# Altium schematic sheet Sheet_MCU_IO.SchDoc: MCU and I/O scheme
size A3; Organization: Altium Limited; Address1: L3, 12a Rodborough Rd; Address2: Frenchs Forest; Address3: NSW; Address4: Australia 2086
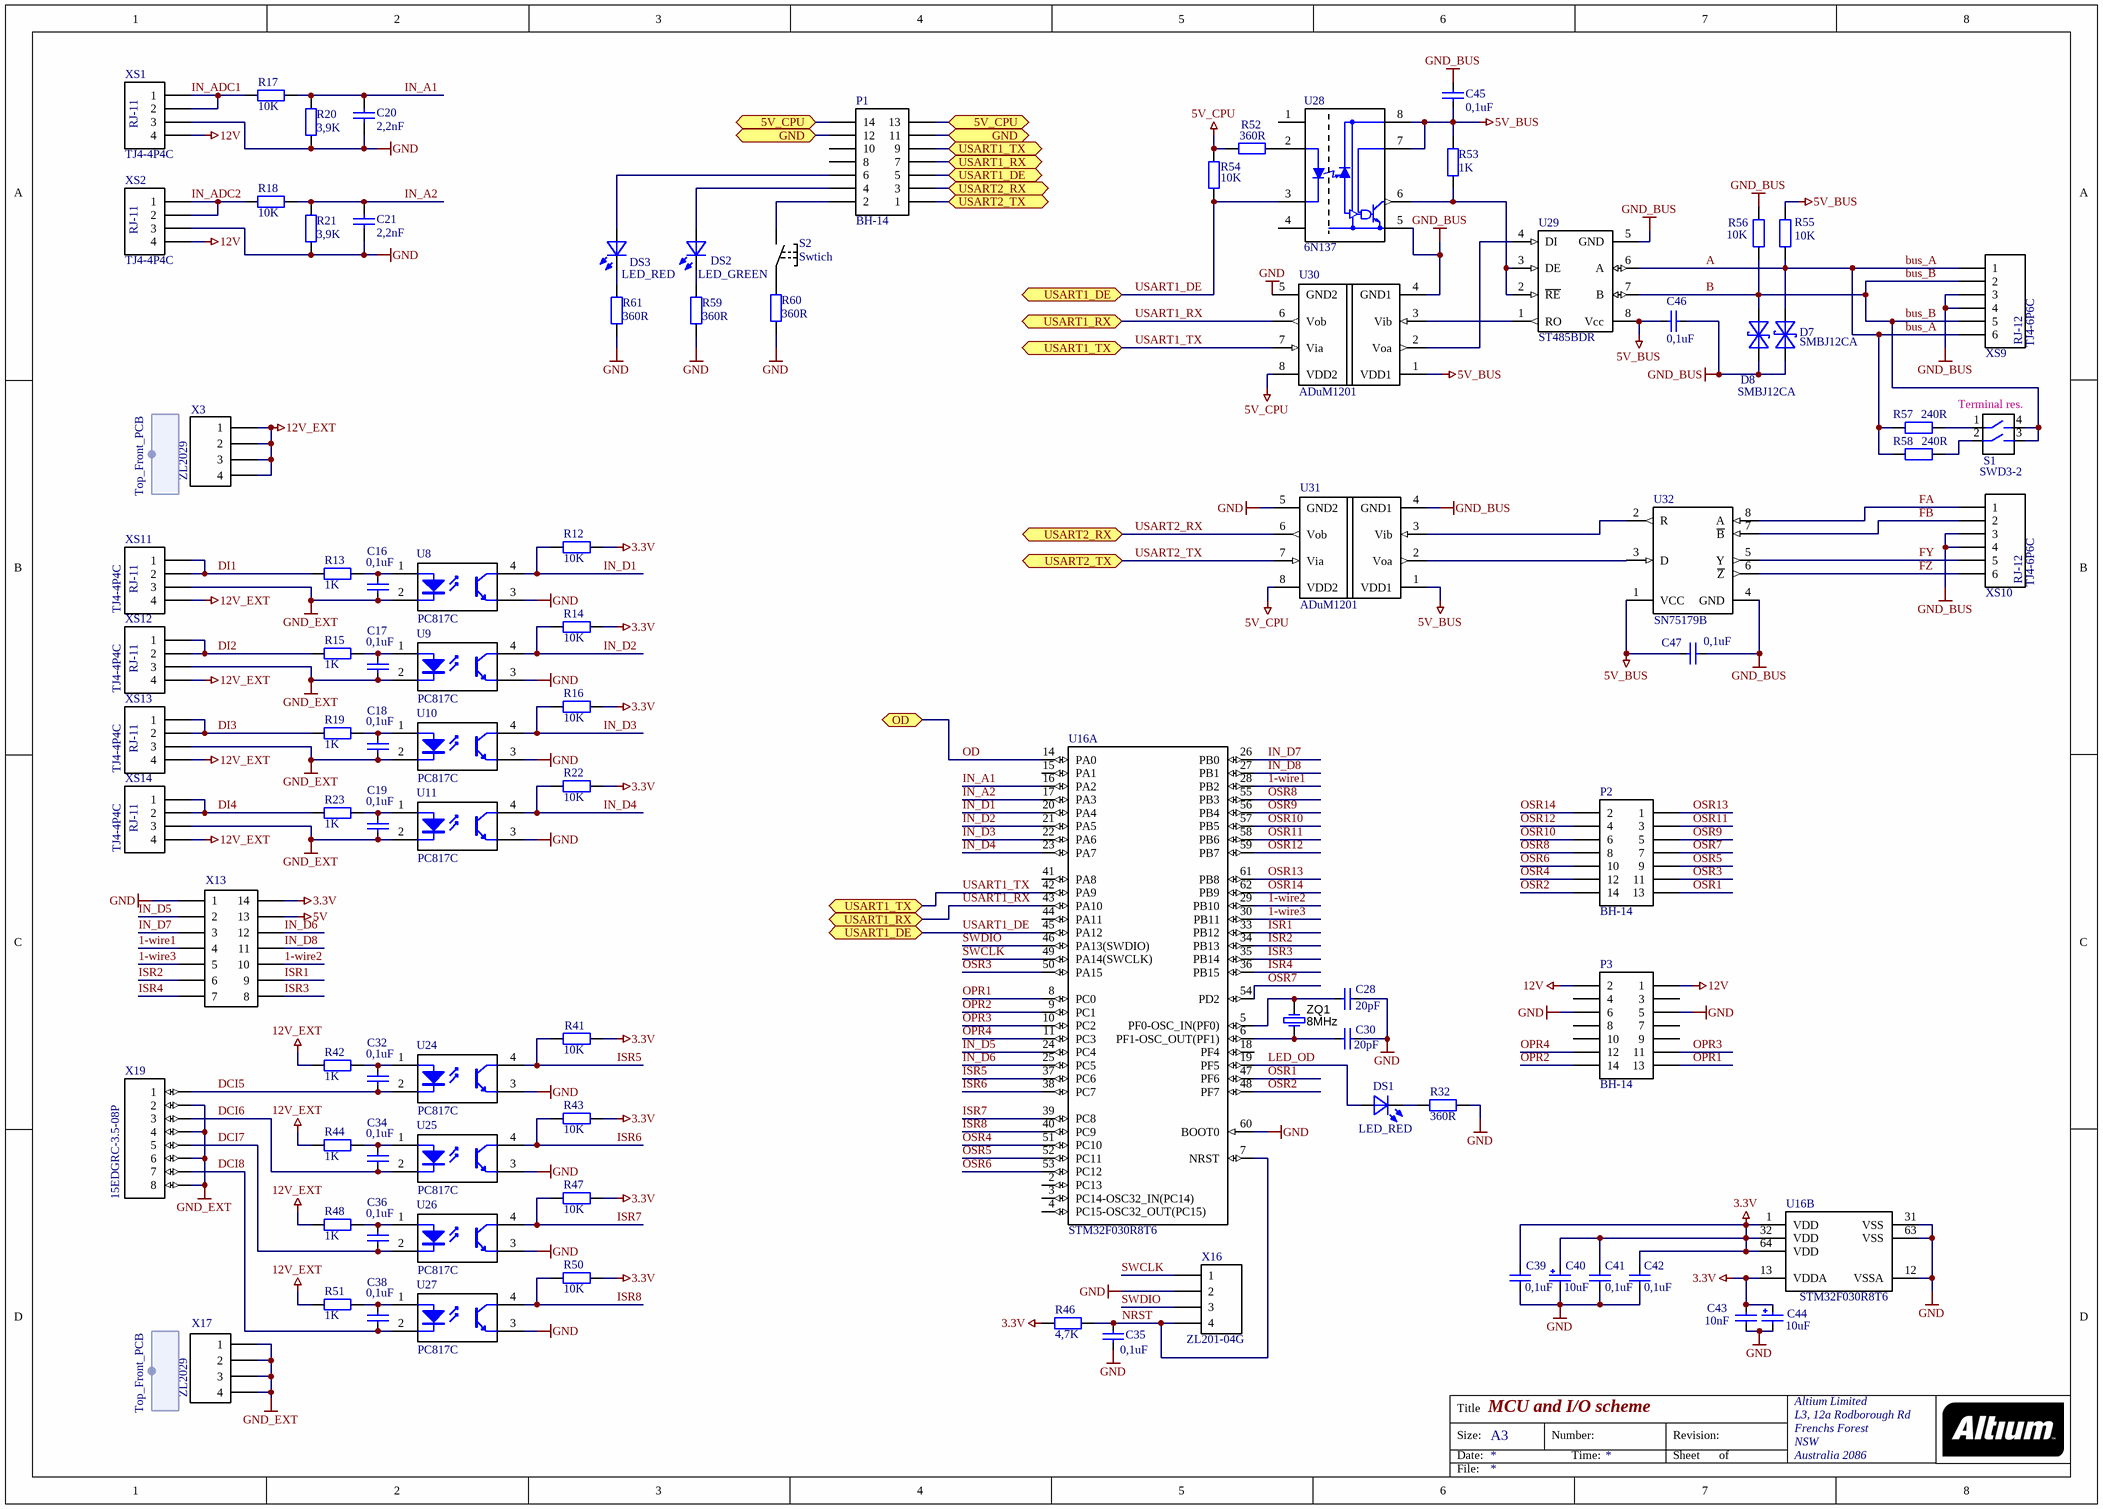
[diagram p0: Sheet_MCU_IO.SchDoc]

## Parts
C16  0,1uF  [C_0805]
C17  0,1uF  [C_0805]
C18  0,1uF  [C_0805]
C19  0,1uF  [C_0805]
C20  value 2,2nF  [C_0805]  (hidden comment: Cap_Semi)
C21  value 2,2nF  [C_0805]  (hidden comment: Cap_Semi)
C28  20pF  [C_0805]
C30  20pF  [C_0805]
C32  0,1uF  [C_0805]
C34  0,1uF  [C_0805]
C35  0,1uF  [C_0805]
C36  0,1uF  [C_0805]
C38  0,1uF  [C_0805]
C39  0,1uF  [C_0805]
C40  10uF  [5x11]
C41  0,1uF  [C_0805]
C42  0,1uF  [C_0805]
C43  10nF  [C_0805]
C44  10uF  [5x11]
C45  0,1uF  [C_0805]
C46  0,1uF  [C_0805]
C47  0,1uF  [C_0805]
D7  SMBJ12CA  [SMB]
D8  SMBJ12CA  [SMB]
DS1  LED_RED  [LED_RED]
DS2  LED_GREEN  [LED_GREEN]
DS3  LED_RED  [LED_RED]
P1  BH-14  [BH-14]
P2  BH-14  [BH-14]
P3  BH-14  [BH-14]
R12  value 10K  [R_0805]  (hidden comment: Resistor)
R13  value 1K  [R_0805]  (hidden comment: Resistor)
R14  value 10K  [R_0805]  (hidden comment: Resistor)
R15  value 1K  [R_0805]  (hidden comment: Resistor)
R16  value 10K  [R_0805]  (hidden comment: Resistor)
R17  value 10K  [R_0805]  (hidden comment: Resistor)
R18  value 10K  [R_0805]  (hidden comment: Resistor)
R19  value 1K  [R_0805]  (hidden comment: Resistor)
R20  value 3,9K  [R_0805]  (hidden comment: Resistor)
R21  value 3,9K  [R_0805]  (hidden comment: Resistor)
R22  value 10K  [R_0805]  (hidden comment: Resistor)
R23  value 1K  [R_0805]  (hidden comment: Resistor)
R32  value 360R  [R_0805]  (hidden comment: Resistor)
R41  value 10K  [R_0805]  (hidden comment: Resistor)
R42  value 1K  [R_0805]  (hidden comment: Resistor)
R43  value 10K  [R_0805]  (hidden comment: Resistor)
R44  value 1K  [R_0805]  (hidden comment: Resistor)
R46  value 4,7K  [R_0805]  (hidden comment: Resistor)
R47  value 10K  [R_0805]  (hidden comment: Resistor)
R48  value 1K  [R_0805]  (hidden comment: Resistor)
R50  value 10K  [R_0805]  (hidden comment: Resistor)
R51  value 1K  [R_0805]  (hidden comment: Resistor)
R52  value 360R  [R_0805]  (hidden comment: Resistor)
R53  value 1K  [R_0805]  (hidden comment: Resistor 0805)
R54  value 10K  [R_0805]  (hidden comment: Resistor)
R55  value 10K  [R_0805]  (hidden comment: Resistor 0805)
R56  value 10K  [R_0805]  (hidden comment: Resistor 0805)
R57  value 240R  [R_1206]  (hidden comment: Resistor 1206)
R58  value 240R  [R_1206]  (hidden comment: Resistor 1206)
R59  value 360R  [R_0805]  (hidden comment: Resistor)
R60  value 360R  [R_0805]  (hidden comment: Resistor)
R61  value 360R  [R_0805]  (hidden comment: Resistor)
S1  SW DIP-2  [Swich_DIP2]  (value not drawn)
S2  Swtich  [Swich_TACTA-68N-F_]
U8  PC817C  [DIP-4]
U9  PC817C  [DIP-4]
U10  PC817C  [DIP-4]
U11  PC817C  [DIP-4]
U16  STM32F030R8T6  [LQFP64_L]  (parts A,B of 2)
U24  PC817C  [DIP-4]
U25  PC817C  [DIP-4]
U26  PC817C  [DIP-4]
U27  PC817C  [DIP-4]
U28  6N137  [DIP-8]
U29  ST485BDR  [SO-8_N]
U30  ADuM1201  [SO-8_N]
U31  ADuM1201  [SO-8_N]
U32  SN75179B  [SO-8_L]
X3  ZL2029  [PLS-4-3D]
X13  PLS2-14  [PLS2-14]  (value not drawn)
X16  PLS-4  [PLS-4-3D]  (value not drawn)
X17  PLS-4  [PLS-4-3D]  (value not drawn)
X19  15EDGRC-3.5-08P  [MC_3.5_8]
XS1  RJ-11  [RJ-11 - TJ4-4P4C]  (value not drawn)
XS2  RJ-11  [RJ-11 - TJ4-4P4C]  (value not drawn)
XS9  RJ-12  [RJ-12 - TJ4-6P6C]  (value not drawn)
XS10  RJ-12  [RJ-12 - TJ4-6P6C]  (value not drawn)
XS11  RJ-11  [RJ-11 - TJ4-4P4C]  (value not drawn)
XS12  RJ-11  [RJ-11 - TJ4-4P4C]  (value not drawn)
XS13  RJ-11  [RJ-11 - TJ4-4P4C]  (value not drawn)
XS14  RJ-11  [RJ-11 - TJ4-4P4C]  (value not drawn)
ZQ1  8MHz  [HC49S_3D]

## Ports
5V_CPU, GND, OD, USART1_DE, USART1_RX, USART1_TX, USART2_RX, USART2_TX

## Harnesses
Top_Front_PCB: 

## Nets
3.3V: C39.1 C40.1 C41.1 C42.1 C43.1 C44.1 R12.1 R14.1 R16.1 R22.1 R41.1 R43.1 R46.1 R47.1 R50.1 U16.1(VDD) U16.13(VDDA) U16.32(VDD) U16.64(VDD) X13.14
5V: X13.13
5V_BUS: C45.1 C46.2 C47.2 R53.2 R55.2 U28.7(Ve) U28.8(Vcc) U29.8(Vcc) U30.1(VDD1) U31.1(VDD1) U32.1(VCC)
5V_CPU: R52.2 R54.2 U30.8(VDD2) U31.8(VDD2)
12V: P3.1 P3.2 XS1.4 XS2.4
12V_EXT: R42.2 R44.2 R48.2 R51.2 X3.1 X3.2 X3.3 X3.4 XS11.4 XS12.4 XS13.4 XS14.4
GND: C20.2 C21.2 C28.1 C30.1 C35.2 C39.2 C40.2 C41.2 C42.2 C43.2 C44.2 P3.5 P3.6 R20.2 R21.2 R32.2 R59.2 R60.2 R61.2 U8.3(E) U9.3(E) U10.3(E) U11.3(E) U16.12(VSSA) U16.31(VSS) U16.60(BOOT0) U16.63(VSS) U24.3(E) U25.3(E) U26.3(E) U27.3(E) U30.5(GND2) U31.5(GND2) X13.1 X16.2 XS1.3 XS2.3
GND_BUS: C45.2 C46.1 C47.1 D7.1(A) D8.2(C) R56.2 U28.5(GND) U29.5(GND) U30.4(GND1) U31.4(GND1) U32.4(GND) XS9.3 XS9.4 XS10.3 XS10.4
GND_EXT: C16.2 C17.2 C18.2 C19.2 U8.2(K) U9.2(K) U10.2(K) U11.2(K) X17.1 X17.2 X17.3 X17.4 X19.2 X19.4 X19.6 X19.8 XS11.3 XS12.3 XS13.3 XS14.3
1-wire1: U16.28(PB2) X13.4
1-wire2: U16.29(PB10) X13.10
1-wire3: U16.30(PB11) X13.5
5V_CPU: P1.13 P1.14 ; port 5V_CPU  [a separate net that carries the same name]
A: D7.2(C) R55.1 R57.1 R58.1 U29.6(A) XS9.1 XS9.6  [also labelled bus_A]
B: D8.1(A) R56.1 S1.3 S1.4 U29.7(B) XS9.2 XS9.5  [also labelled bus_B]
DCI5: C32.2 U24.2(K) X19.1
DCI6: C34.2 U25.2(K) X19.3
DCI7: C36.2 U26.2(K) X19.5
DCI8: C38.2 U27.2(K) X19.7
DI1: R13.2 XS11.1 XS11.2
DI2: R15.2 XS12.1 XS12.2
DI3: R19.2 XS13.1 XS13.2
DI4: R23.2 XS14.1 XS14.2
FA: U32.8(A) XS10.1
F~{B}: U32.7(~{B}) XS10.2
FY: U32.5(Y) XS10.5
F~{Z}: U32.6(~{Z}) XS10.6
GND: P1.11 P1.12 ; port GND  [a separate net that carries the same name]
IN_A1: C20.1 R17.1 R20.1 U16.16(PA2)
IN_A2: C21.1 R18.1 R21.1 U16.17(PA3)
IN_ADC1: R17.2 XS1.1 XS1.2
IN_ADC2: R18.2 XS2.1 XS2.2
IN_D1: R12.2 U8.4(C) U16.20(PA4)
IN_D2: R14.2 U9.4(C) U16.21(PA5)
IN_D3: R16.2 U10.4(C) U16.22(PA6)
IN_D4: R22.2 U11.4(C) U16.23(PA7)
IN_D5: U16.24(PC4) X13.2
IN_D6: U16.25(PC5) X13.12
IN_D7: U16.26(PB0) X13.3
IN_D8: U16.27(PB1) X13.11
ISR1: U16.33(PB12) X13.9
ISR2: U16.34(PB13) X13.6
ISR3: U16.35(PB14) X13.8
ISR4: U16.36(PB15) X13.7
ISR5: R41.2 U16.37(PC6) U24.4(C)
ISR6: R43.2 U16.38(PC7) U25.4(C)
ISR7: R47.2 U16.39(PC8) U26.4(C)
ISR8: R50.2 U16.40(PC9) U27.4(C)
LED_OD: DS1.1(A) U16.19(PF5)
NRST: C35.1 R46.2 U16.7(NRST) X16.4
OD: U16.14(PA0) ; port OD
OPR1: P3.13 U16.8(PC0)
OPR2: P3.14 U16.9(PC1)
OPR3: P3.11 U16.10(PC2)
OPR4: P3.12 U16.11(PC3)
OSR1: P2.13 U16.47(PF6)
OSR2: P2.14 U16.48(PF7)
OSR3: P2.11 U16.50(PA15)
OSR4: P2.12 U16.51(PC10)
OSR5: P2.9 U16.52(PC11)
OSR6: P2.10 U16.53(PC12)
OSR7: P2.7 U16.54(PD2)
OSR8: P2.8 U16.55(PB3)
OSR9: P2.5 U16.56(PB4)
OSR10: P2.6 U16.57(PB5)
OSR11: P2.3 U16.58(PB6)
OSR12: P2.4 U16.59(PB7)
OSR13: P2.1 U16.61(PB8)
OSR14: P2.2 U16.62(PB9)
SWCLK: U16.49(PA14(SWCLK)) X16.1
SWDIO: U16.46(PA13(SWDIO)) X16.3
USART1_DE: P1.5 R54.1 U16.45(PA12) U28.3(C) ; port USART1_DE
USART1_RX: P1.7 U16.43(PA10) U30.6(Vob) ; port USART1_RX
USART1_TX: P1.9 U16.42(PA9) U30.7(Via) ; port USART1_TX
USART2_RX: P1.3 U31.6(Vob) ; port USART2_RX
USART2_TX: P1.1 U31.7(Via) ; port USART2_TX
NetC16_1: C16.1 R13.1 U8.1(A)
NetC17_1: C17.1 R15.1 U9.1(A)
NetC18_1: C18.1 R19.1 U10.1(A)
NetC19_1: C19.1 R23.1 U11.1(A)
NetC28_2: C28.2 U16.5(PF0-OSC_IN(PF0)) ZQ1.2(OSC2)
NetC30_2: C30.2 U16.6(PF1-OSC_OUT(PF1)) ZQ1.1(OSC1)
NetC32_1: C32.1 R42.1 U24.1(A)
NetC34_1: C34.1 R44.1 U25.1(A)
NetC36_1: C36.1 R48.1 U26.1(A)
NetC38_1: C38.1 R51.1 U27.1(A)
NetDS1_2: DS1.2(C) R32.1
NetDS2_1: DS2.1(A) P1.4
NetDS2_2: DS2.2(C) R59.1
NetDS3_1: DS3.1(A) P1.6
NetDS3_2: DS3.2(C) R61.1
NetP1_2: P1.2 S2.2(NO)
NetR52_1: R52.1 U28.2(A)
NetR53_1: R53.1 U28.6(Vo) U29.2(~{RE}) U29.3(DE)
NetR57_2: R57.2 S1.1
NetR58_2: R58.2 S1.2
NetR60_1: R60.1 S2.1(COMMON)
NetU29_1: U29.1(RO) U30.3(Vib)
NetU29_4: U29.4(DI) U30.2(Voa)
NetU31_2: U31.2(Voa) U32.3(D)
NetU31_3: U31.3(Vib) U32.2(R)

Not connected (* = marked no-connect by the designer): P1 8 10; P3 3 4 7 8 9 10; U16 2(PC13) 3(PC14-OSC32_IN(PC14)) 4(PC15-OSC32_OUT(PC15)) 15(PA1) 18(PF4) 41(PA8) 44(PA11); U28 1(NC) 4(NC)

## Notes on the sheet
- (near S1) Terminal res.
- Title
- Size:
- Date:
- A3
- Number:
- Time:
- Revision:
- Sheet
- of
- File:
- (in symbol SW DIP-2) SWD3-2

## Library data of the parts
C16-C19 C28 C30 C32 C34-C36 C38 C39 C41-C43 C45-C47 = Cap_Semi: Capacitor semi
C20 C21 = Cap_Semi: Capacitor Semi
C40 C44 = Capacitor Polar
D7 D8 = SMBJ12CA: Supressor
DS1 DS3 = LED_RED: LED
DS2 = LED_GREEN: LED
P1-P3 = BH-14: IDC/BH; LatestRevisionDate: 17-Jul-2002; LatestRevisionNote: Re-released for DXP Platform.; Publisher: Altium Limited
S1 = SW DIP-2: DIP Switch_2
U8-U11 U24-U27 = PC817: Optocoupler
U16 = STM32F030R8T6: ARM Cortex-M0 32-bit MCU, 64 KB Flash, 8 KB Internal RAM, 55 I/Os, 64-pin LQFP, -40 to 85 degC, Tray
U28 = 6N137: Optocoupler
U29 = ST485BDR: RS-485/RS-422 Transceiver
U30 U31 = ADuM1201: Dual-Channel Digital Isolators
U32 = SN75179B: RS485/RS422 Differential driver and receiver pair
X3 = PLS-4: Header, 4-Pin; LatestRevisionDate: 17-Jul-2002; LatestRevisionNote: Re-released for DXP Platform.; Publisher: Altium Limited
X13 = PLS2-14: Header, 14-Pin
X16 = PLS-4: ZL201-04G; LatestRevisionDate: 17-Jul-2002; LatestRevisionNote: Re-released for DXP Platform.; Publisher: Altium Limited
X17 = PLS-4: ZL2029; LatestRevisionDate: 17-Jul-2002; LatestRevisionNote: Re-released for DXP Platform.; Publisher: Altium Limited
X19 = MC_3.5_8: Connector 3.5mm
XS1 XS2 XS11-XS14 = RJ-11: TJ4-4P4C
XS9 XS10 = RJ-12: TJ4-6P6C
ZQ1 = XTAL: Crystal Oscillator; Published: 8-Jun-2000; LatestRevisionDate: 17-Jul-2002; LatestRevisionNote: Re-released for DXP Platform.; PackageReference: R38; Publisher: Altium Limited